# EAGLE design Memory (EAGLE 9.6.2)
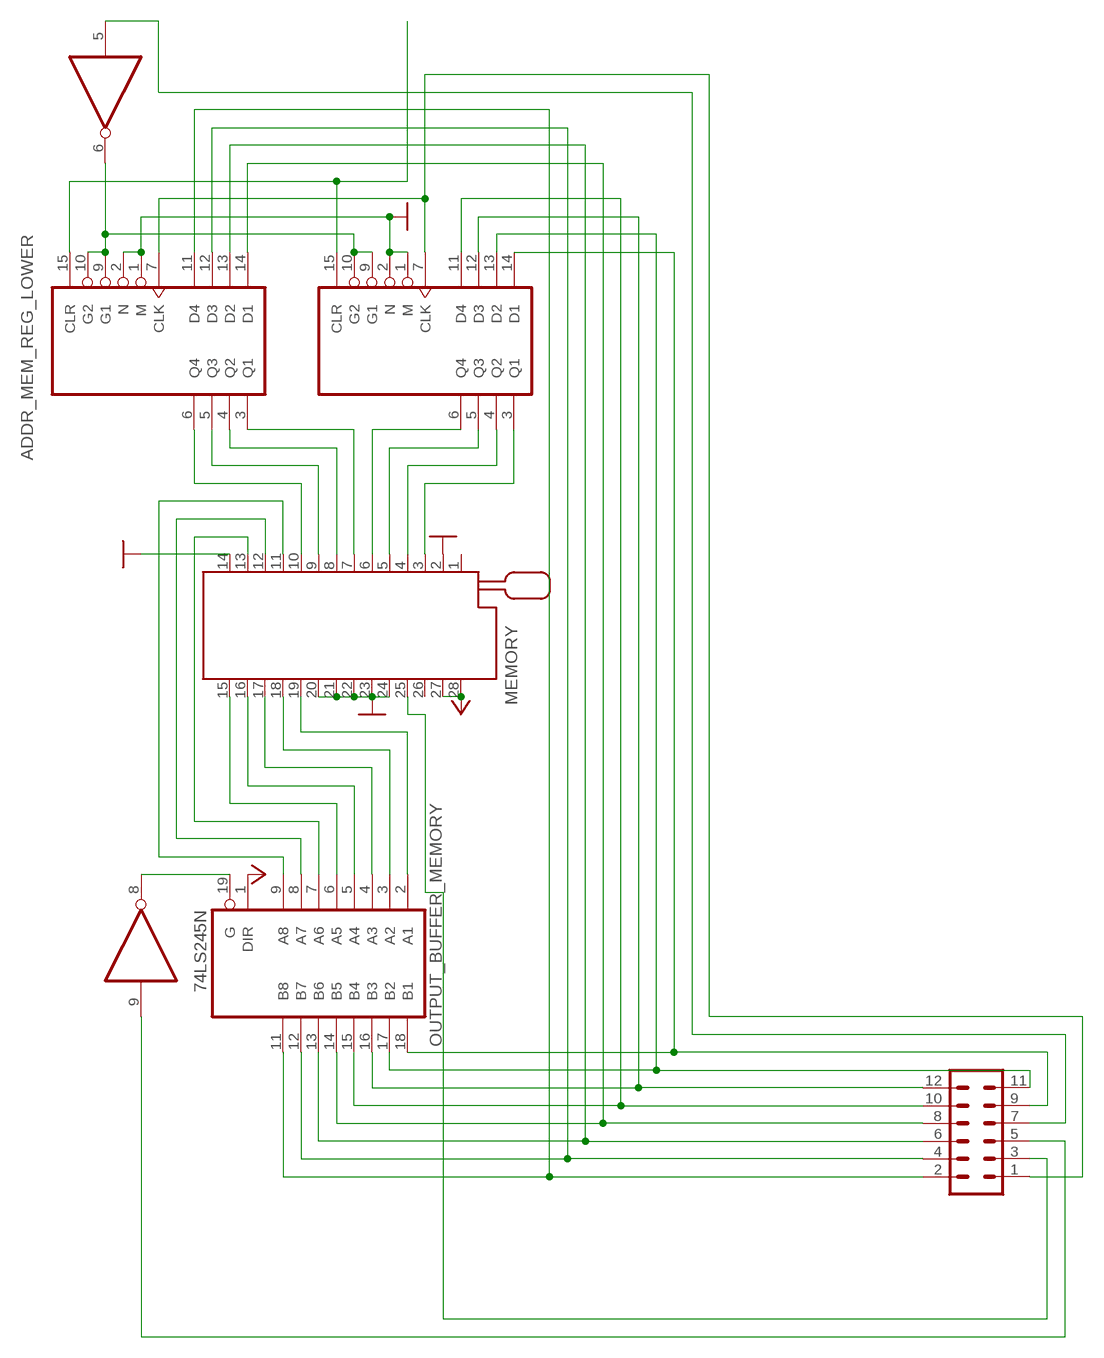
[diagram p0: schematic, sheet 1]

## Parts
ADDR_MEM_REG_LOWER  74LS173N  [DIL16]
ADDR_MEM_REG_UPPER  74LS173N  [DIL16]
MEMORY  228-1277-00-0602J  [228-1277-00-0602J]
NOT_GATE1_  74LS04N  [DIL14]
OUTPUT_BUFFER_MEMORY  74LS245N  [DIL20]
SV1  MA06-2  [MA06-2]

## Nets
1_PLACE1 [Databus]: ADDR_MEM_REG_LOWER.11(D4) OUTPUT_BUFFER_MEMORY.11(B8) SV1.2
2_PLACE [Databus]: ADDR_MEM_REG_LOWER.12(D3) OUTPUT_BUFFER_MEMORY.12(B7) SV1.4
4_PLACE [Databus]: ADDR_MEM_REG_LOWER.13(D2) OUTPUT_BUFFER_MEMORY.13(B6) SV1.6
8_PLACE [Databus]: ADDR_MEM_REG_LOWER.14(D1) OUTPUT_BUFFER_MEMORY.14(B5) SV1.8
16_PLACE [Databus]: ADDR_MEM_REG_UPPER.11(D4) OUTPUT_BUFFER_MEMORY.15(B4) SV1.10
32_PLACE [Databus]: ADDR_MEM_REG_UPPER.12(D3) OUTPUT_BUFFER_MEMORY.16(B3) SV1.12
64_PLACE [Databus]: ADDR_MEM_REG_UPPER.13(D2) OUTPUT_BUFFER_MEMORY.17(B2) SV1.11
128_PLACE [Databus]: ADDR_MEM_REG_UPPER.14(D1) OUTPUT_BUFFER_MEMORY.18(B1) SV1.9
CLOCK: ADDR_MEM_REG_LOWER.7(CLK) ADDR_MEM_REG_UPPER.7(CLK) SV1.1
CLR_REG: ADDR_MEM_REG_LOWER.15(CLR) ADDR_MEM_REG_UPPER.15(CLR)
GND: ADDR_MEM_REG_LOWER.1(M) ADDR_MEM_REG_LOWER.2(N) ADDR_MEM_REG_UPPER.1(M) ADDR_MEM_REG_UPPER.2(N) MEMORY.2 MEMORY.14 MEMORY.20 MEMORY.21 MEMORY.22 MEMORY.23 MEMORY.24
MEMORY_IN: NOT_GATE1_.5(C:I) SV1.7
MEMORY_OUT: NOT_GATE1_.9(D:I) SV1.5
N$149: ADDR_MEM_REG_LOWER.6(Q4) MEMORY.10
N$150: ADDR_MEM_REG_LOWER.5(Q3) MEMORY.9
N$151: ADDR_MEM_REG_LOWER.4(Q2) MEMORY.8
N$152: ADDR_MEM_REG_LOWER.3(Q1) MEMORY.7
N$153: ADDR_MEM_REG_UPPER.6(Q4) MEMORY.6
N$154: ADDR_MEM_REG_UPPER.5(Q3) MEMORY.5
N$155: ADDR_MEM_REG_UPPER.4(Q2) MEMORY.4
N$156: ADDR_MEM_REG_UPPER.3(Q1) MEMORY.3
N$157: MEMORY.13 OUTPUT_BUFFER_MEMORY.7(A6)
N$158: MEMORY.12 OUTPUT_BUFFER_MEMORY.8(A7)
N$159: MEMORY.11 OUTPUT_BUFFER_MEMORY.9(A8)
N$160: MEMORY.15 OUTPUT_BUFFER_MEMORY.6(A5)
N$161: MEMORY.16 OUTPUT_BUFFER_MEMORY.5(A4)
N$162: MEMORY.17 OUTPUT_BUFFER_MEMORY.4(A3)
N$163: MEMORY.18 OUTPUT_BUFFER_MEMORY.3(A2)
N$164: MEMORY.19 OUTPUT_BUFFER_MEMORY.2(A1)
VCC: MEMORY.27 MEMORY.28 OUTPUT_BUFFER_MEMORY.1(DIR)
~DATA/PARAM: MEMORY.25 SV1.3
~MEMORY_IN: ADDR_MEM_REG_LOWER.9(G1) ADDR_MEM_REG_LOWER.10(G2) ADDR_MEM_REG_UPPER.9(G1) ADDR_MEM_REG_UPPER.10(G2) NOT_GATE1_.6(C:O)
~MEMORY_OUT: NOT_GATE1_.8(D:O) OUTPUT_BUFFER_MEMORY.19(G)
Unconnected: MEMORY.1 MEMORY.26 NOT_GATE1_.1(A:I) NOT_GATE1_.2(A:O) NOT_GATE1_.3(B:I) NOT_GATE1_.4(B:O) NOT_GATE1_.10(E:O) NOT_GATE1_.11(E:I) NOT_GATE1_.12(F:O) NOT_GATE1_.13(F:I)

## Power pins joined to a net without a drawn wire
GND: ADDR_MEM_REG_LOWER.8(GND) ADDR_MEM_REG_UPPER.8(GND) NOT_GATE1_.7(P:GND) OUTPUT_BUFFER_MEMORY.10(GND)
VCC: ADDR_MEM_REG_LOWER.16(VCC) ADDR_MEM_REG_UPPER.16(VCC) NOT_GATE1_.14(P:VCC) OUTPUT_BUFFER_MEMORY.20(VCC)

## Library data of the parts
ADDR_MEM_REG_LOWER ADDR_MEM_REG_UPPER = 74xx-eu:74*173: 4-bit D type REGISTER, 3-state
MEMORY = con-3m:228-?00-0602J: Zero Insertion Force Socked Source: http://www.3M.com/ehpd; MF: 3M; MPN: 228-1277-00-0602J; OC_FARNELL: 9897356; OC_NEWARK: 85K7825
NOT_GATE1_ = 74xx-eu:74*04: Hex INVERTER
OUTPUT_BUFFER_MEMORY = 74xx-eu:74*245: Octal BUS TRANSCEIVER, 3-state
SV1 = con-lstb:MA06-2: PIN HEADER; OC_FARNELL: unknown; OC_NEWARK: unknown

## Board
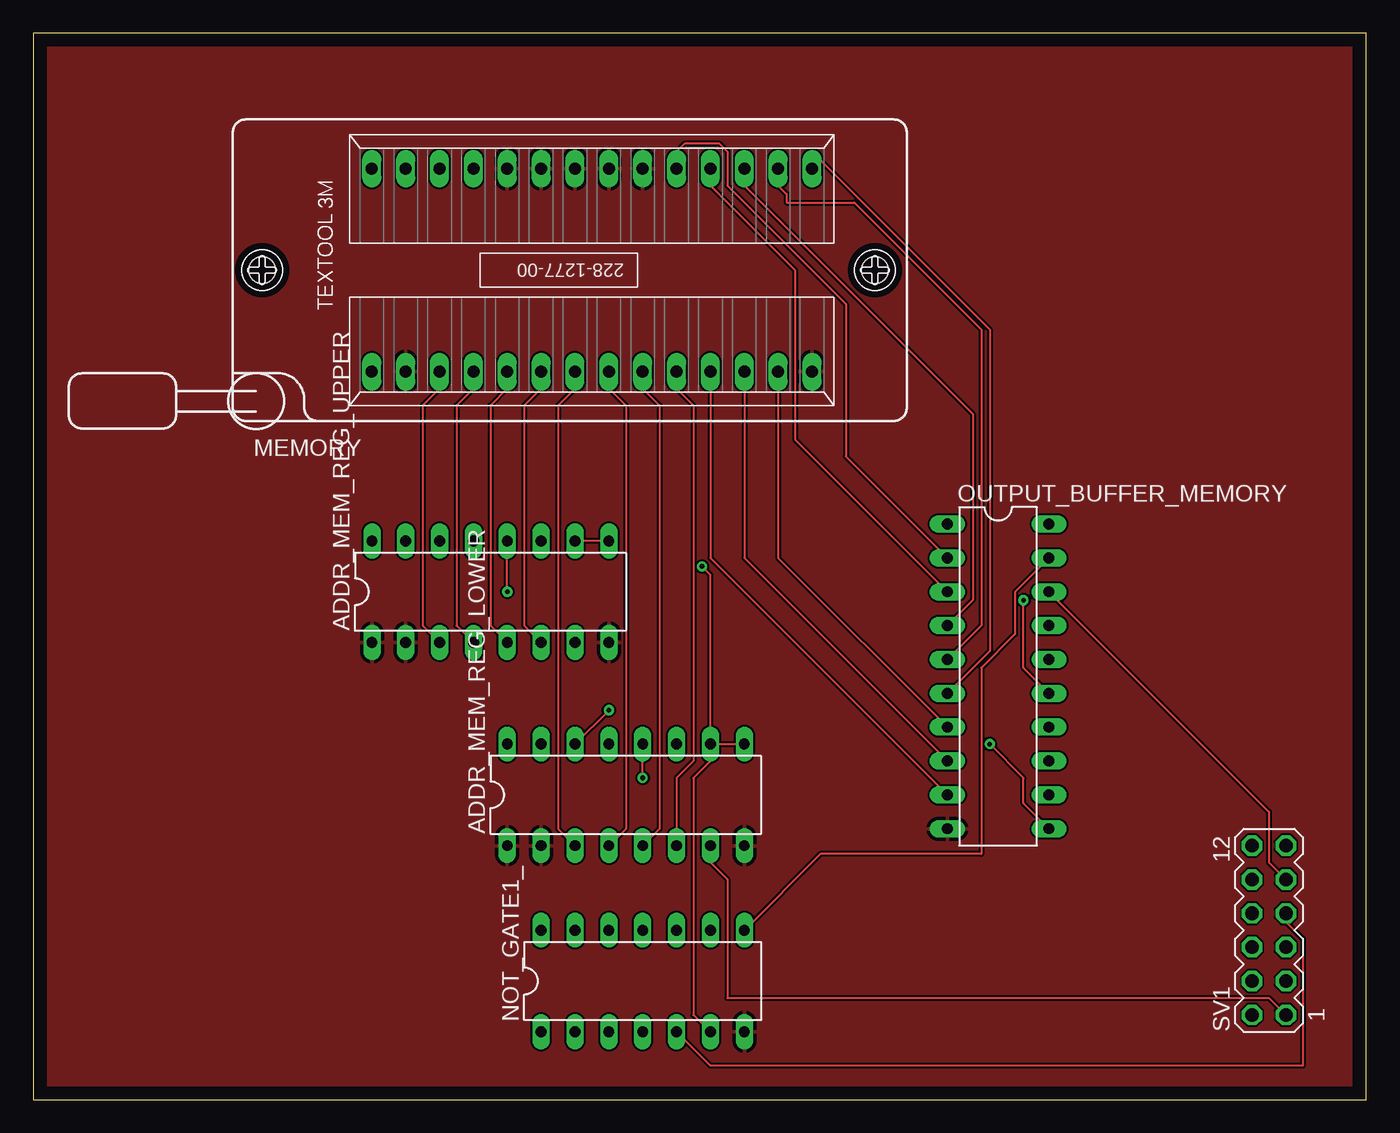
[diagram p1: board, top side]
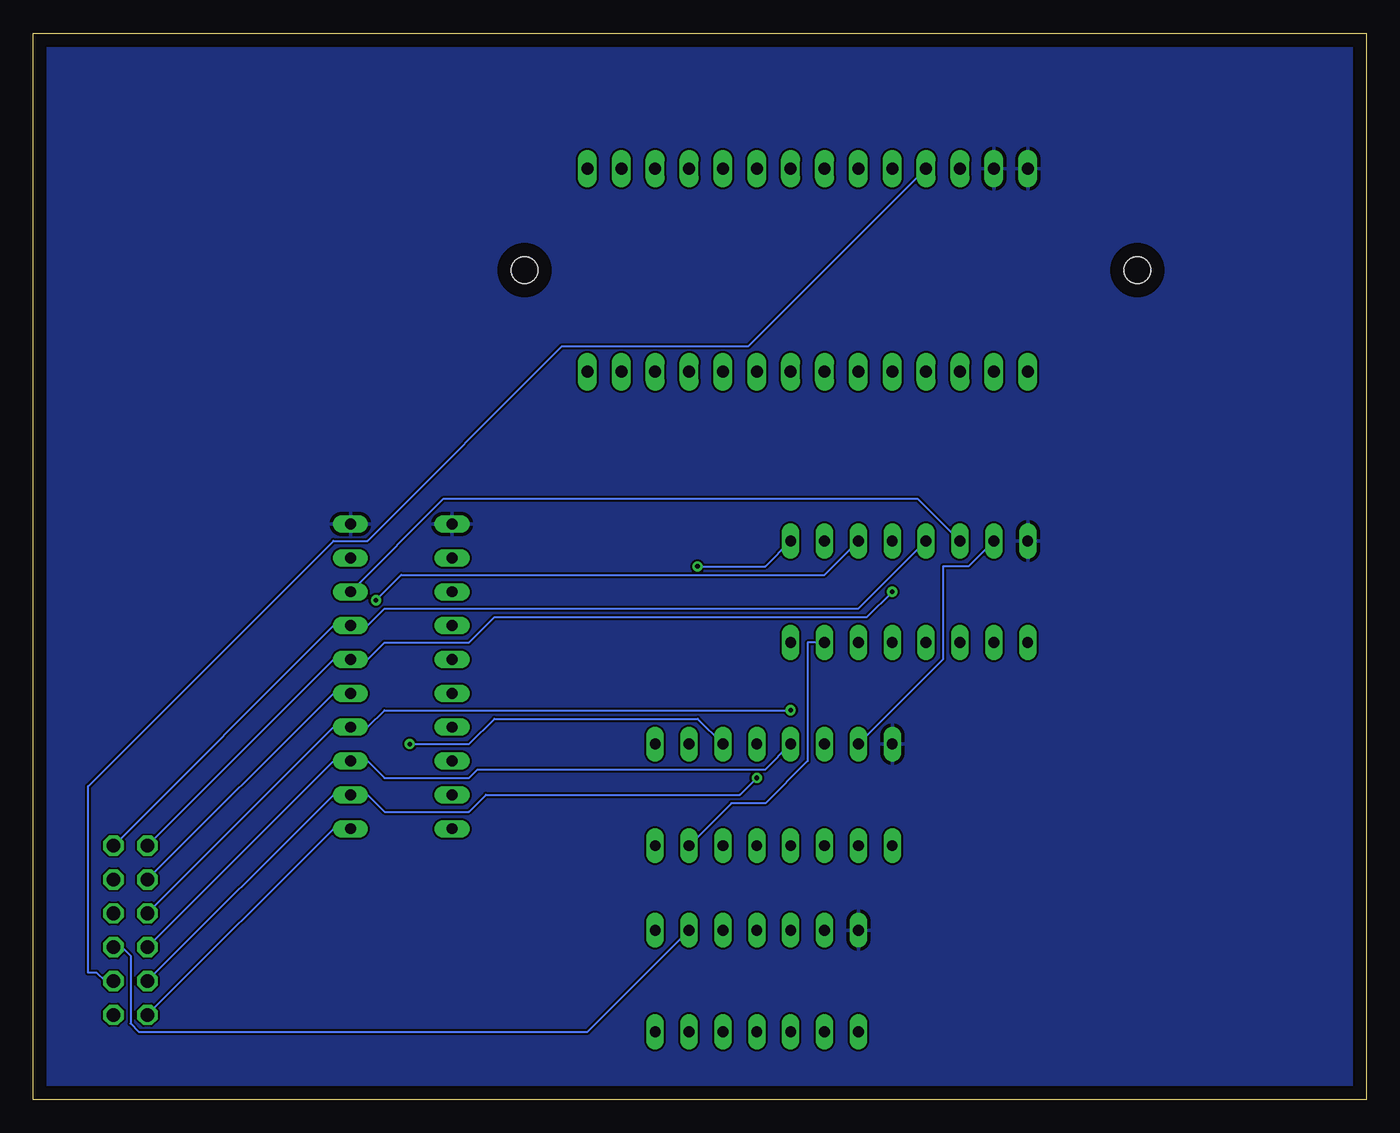
[diagram p2: board, bottom side, seen from below]

Size 100 x 80 mm. Coordinates in mm from the lower left corner, seen from the top.
Outline: 0,0 100,0 100,80 0,80 0,0
Copper layers (1*16): Top 0.035mm / dielectric 1.5mm / Bottom 0.035mm
Design rules "default": minimum track width 6mil, minimum drill 0.35mm, track to track 6mil, track to pad 6mil, pad to pad 6mil, via to via 6mil, smd to smd 6mil, copper to edge 40mil, drill to drill 6mil, minimum pad ring 10mil, minimum via ring 8mil, stop-mask expansion 4mil, vias tented up to drill 0mil, thermal gap 10mil

### Footprints (pad centres in the part's own frame; a part is rotated, then mirrored left to right if it is on the bottom)
DIL16 = drill 0.813 long: 1 -8.89,-3.81; 2 -6.35,-3.81; 3 -3.81,-3.81; 4 -1.27,-3.81; 5 1.27,-3.81; 6 3.81,-3.81; 7 6.35,-3.81; 8 8.89,-3.81; 9 8.89,3.81; 10 6.35,3.81; 11 3.81,3.81; 12 1.27,3.81; 13 -1.27,3.81; 14 -3.81,3.81; 15 -6.35,3.81; 16 -8.89,3.81
228-1277-00-0602J = drill 0.9 long: 1 -16.51,-7.62; 2 -13.97,-7.62; 3 -11.43,-7.62; 4 -8.89,-7.62; 5 -6.35,-7.62; 6 -3.81,-7.62; 7 -1.27,-7.62; 8 1.27,-7.62; 9 3.81,-7.62; 10 6.35,-7.62; 11 8.89,-7.62; 12 11.43,-7.62; 13 13.97,-7.62; 14 16.51,-7.62; 15 16.51,7.62; 16 13.97,7.62; 17 11.43,7.62; 18 8.89,7.62; 19 6.35,7.62; 20 3.81,7.62; 21 1.27,7.62; 22 -1.27,7.62; 23 -3.81,7.62; 24 -6.35,7.62; 25 -8.89,7.62; 26 -11.43,7.62; 27 -13.97,7.62; 28 -16.51,7.62 | hole 2: 21.24,0; -24.74,0
DIL14 = drill 0.813 long: 1 -7.62,-3.81; 2 -5.08,-3.81; 3 -2.54,-3.81; 4 0,-3.81; 5 2.54,-3.81; 6 5.08,-3.81; 7 7.62,-3.81; 8 7.62,3.81; 9 5.08,3.81; 10 2.54,3.81; 11 0,3.81; 12 -2.54,3.81; 13 -5.08,3.81; 14 -7.62,3.81
DIL20 = drill 0.813 long: 1 -11.43,-3.81; 2 -8.89,-3.81; 3 -6.35,-3.81; 4 -3.81,-3.81; 5 -1.27,-3.81; 6 1.27,-3.81; 7 3.81,-3.81; 8 6.35,-3.81; 9 8.89,-3.81; 10 11.43,-3.81; 11 11.43,3.81; 12 8.89,3.81; 13 6.35,3.81; 14 3.81,3.81; 15 1.27,3.81; 16 -1.27,3.81; 17 -3.81,3.81; 18 -6.35,3.81; 19 -8.89,3.81; 20 -11.43,3.81
MA06-2 = drill 1.016 octagon: 1 -6.35,-1.27; 2 -6.35,1.27; 3 -3.81,-1.27; 4 -3.81,1.27; 5 -1.27,-1.27; 6 -1.27,1.27; 7 1.27,-1.27; 8 1.27,1.27; 9 3.81,-1.27; 10 3.81,1.27; 11 6.35,-1.27; 12 6.35,1.27

### Placement (x,y rotation side)
ADDR_MEM_REG_LOWER  44.45,22.86 0 top
ADDR_MEM_REG_UPPER  34.29,38.1 0 top
MEMORY  41.91,62.23 0 top
NOT_GATE1_  45.72,8.89 0 top
OUTPUT_BUFFER_MEMORY  72.39,31.75 270 top
SV1  92.71,12.7 90 top

### Tracks (layer width: path | path; a pad name or v marks a point on that pad's centre or on a via)
1_PLACE1  (via drill 0.35)
  Top 0.152: v71.75,26.67 74.3,24.13 74.3,22.23 OUTPUT_BUFFER_MEMORY.11
  Bottom 0.152: ADDR_MEM_REG_LOWER.11 50.16,28.57 65.41,28.57 67.31,26.67 v71.75,26.67 | SV1.2 77.47,20.32 OUTPUT_BUFFER_MEMORY.11
2_PLACE  (via drill 0.35)
  Top 0.152: v45.72,24.13 ADDR_MEM_REG_LOWER.12
  Bottom 0.152: v45.72,24.13 46.99,22.86 66.04,22.86 67.31,21.59 73.66,21.59 74.93,22.86 OUTPUT_BUFFER_MEMORY.12 77.47,22.86 SV1.4
4_PLACE
  Bottom 0.152: ADDR_MEM_REG_LOWER.13 45.09,24.77 66.67,24.77 67.31,24.13 73.66,24.13 74.93,25.4 OUTPUT_BUFFER_MEMORY.13 77.47,25.4 SV1.6
8_PLACE  (via drill 0.35)
  Top 0.152: v43.18,29.21 ADDR_MEM_REG_LOWER.14
  Bottom 0.152: v43.18,29.21 73.66,29.21 74.93,27.94 OUTPUT_BUFFER_MEMORY.14 77.47,27.94 SV1.8
16_PLACE  (via drill 0.35)
  Top 0.152: v74.3,37.47 74.3,32.38 OUTPUT_BUFFER_MEMORY.15
  Bottom 0.152: ADDR_MEM_REG_UPPER.11 40.64,39.37 72.39,39.37 v74.3,37.47 | SV1.10 77.47,30.48 OUTPUT_BUFFER_MEMORY.15
32_PLACE  (via drill 0.35)
  Top 0.152: v35.56,38.1 ADDR_MEM_REG_UPPER.12
  Bottom 0.152: v35.56,38.1 37.47,36.2 65.41,36.2 67.31,34.29 73.66,34.29 74.93,33.02 OUTPUT_BUFFER_MEMORY.16 77.47,33.02 SV1.12
64_PLACE
  Bottom 0.152: ADDR_MEM_REG_UPPER.13 38.1,36.83 73.66,36.83 74.93,35.56 OUTPUT_BUFFER_MEMORY.17 77.47,35.56 SV1.11
128_PLACE
  Top 0.152: SV1.9 92.71,17.78 92.71,21.59 OUTPUT_BUFFER_MEMORY.18
  Bottom 0.152: ADDR_MEM_REG_UPPER.14 33.66,45.09 69.22,45.09 OUTPUT_BUFFER_MEMORY.18
CLOCK
  Top 0.152: SV1.1 92.71,7.62 52.07,7.62 52.07,16.51 50.8,17.78 ADDR_MEM_REG_LOWER.7
  Bottom 0.152: ADDR_MEM_REG_LOWER.7 47.62,22.23 45.09,22.23 41.91,25.4 41.91,34.29 ADDR_MEM_REG_UPPER.7
CLR_REG
  Bottom 0.152: ADDR_MEM_REG_LOWER.15 31.75,33.02 31.75,40.01 29.84,40.01 ADDR_MEM_REG_UPPER.15
GND
  pour Top: 0,80.01 100.33,80.01 100.33,0 0,0
MEMORY_IN
  Top 0.152: NOT_GATE1_.5 50.8,2.54 95.25,2.54 95.25,12.06 93.98,13.34 SV1.7
MEMORY_OUT
  Bottom 0.152: NOT_GATE1_.9 58.42,5.08 92.08,5.08 92.71,5.71 92.71,10.79 93.34,11.43 SV1.5
N$149
  Top 0.152: ADDR_MEM_REG_LOWER.6 48.26,24.13 49.53,25.4 49.53,52.07 48.26,53.34 MEMORY.10
N$150
  Top 0.152: ADDR_MEM_REG_LOWER.5 46.99,20.32 46.99,52.07 45.72,53.34 MEMORY.9
N$151
  Top 0.152: ADDR_MEM_REG_LOWER.4 44.45,20.32 44.45,52.07 43.18,53.34 MEMORY.8
N$152
  Top 0.152: ADDR_MEM_REG_LOWER.3 39.37,20.32 39.37,52.07 40.64,53.34 MEMORY.7
N$153
  Top 0.152: ADDR_MEM_REG_UPPER.6 36.83,35.56 36.83,52.07 38.1,53.34 MEMORY.6
N$154
  Top 0.152: ADDR_MEM_REG_UPPER.5 34.29,35.56 34.29,52.07 35.56,53.34 MEMORY.5
N$155
  Top 0.152: ADDR_MEM_REG_UPPER.4 31.75,35.56 31.75,52.07 33.02,53.34 MEMORY.4
N$156
  Top 0.152: ADDR_MEM_REG_UPPER.3 29.21,35.56 29.21,52.07 30.48,53.34 MEMORY.3
N$157
  Top 0.152: OUTPUT_BUFFER_MEMORY.7 55.88,40.64 MEMORY.13
N$158
  Top 0.152: OUTPUT_BUFFER_MEMORY.8 53.34,40.64 MEMORY.12
N$159
  Top 0.152: OUTPUT_BUFFER_MEMORY.9 50.8,40.64 MEMORY.11
N$160
  Top 0.152: OUTPUT_BUFFER_MEMORY.6 71.75,33.66 71.75,57.78 59.05,70.48 58.42,70.48 MEMORY.15
N$161
  Top 0.152: OUTPUT_BUFFER_MEMORY.5 71.12,35.56 71.12,57.78 61.59,67.31 56.52,67.31 56.52,67.94 55.88,68.58 MEMORY.16
N$162
  Top 0.152: OUTPUT_BUFFER_MEMORY.4 70.48,37.47 70.48,51.44 53.34,68.58 MEMORY.17
N$163
  Top 0.152: OUTPUT_BUFFER_MEMORY.3 57.15,49.53 57.15,62.23 50.8,68.58 MEMORY.18
N$164
  Top 0.152: OUTPUT_BUFFER_MEMORY.2 60.96,48.26 60.96,59.69 52.07,68.58 52.07,71.12 51.44,71.75 48.9,71.75 48.26,71.12 MEMORY.19
VCC
  pour Bottom: 0,80.01 100.33,80.01 100.33,0 0,0
~DATA/PARAM
  Bottom 0.152: MEMORY.25 46.35,56.52 60.33,56.52 74.93,41.91 77.47,41.91 95.89,23.5 95.89,9.53 95.25,9.53 94.61,8.89 SV1.3
~MEMORY_IN  (via drill 0.35)
  Top 0.152: ADDR_MEM_REG_UPPER.9 ADDR_MEM_REG_UPPER.10 | NOT_GATE1_.6 49.53,6.35 49.53,24.13 50.8,25.4 ADDR_MEM_REG_LOWER.10 | ADDR_MEM_REG_LOWER.10 ADDR_MEM_REG_LOWER.9 | v50.16,40.01 50.8,39.37 ADDR_MEM_REG_LOWER.10
  Bottom 0.152: ADDR_MEM_REG_UPPER.9 45.09,40.01 v50.16,40.01
~MEMORY_OUT
  Top 0.152: NOT_GATE1_.8 59.05,18.41 71.12,18.41 71.12,32.38 73.66,34.92 73.66,38.1 OUTPUT_BUFFER_MEMORY.19